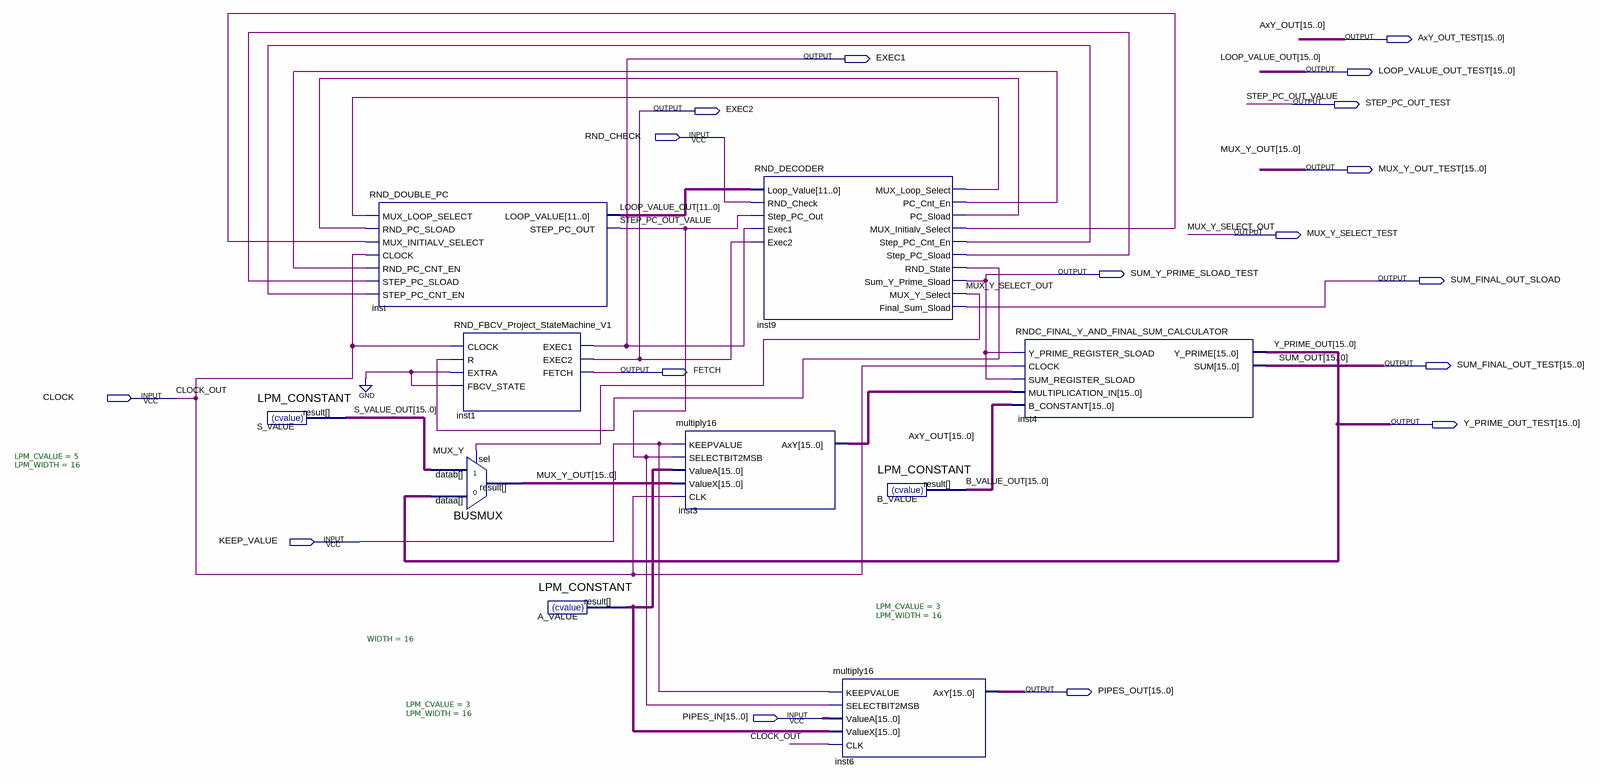
[diagram p0: schematic sheet]
// Quartus schematic RND_TESTING_V1.bdf as structural Verilog: 10 symbols, 17 pins
module RND_TESTING_V1 (
  input  RND_CHECK,
  input  CLOCK,
  input  KEEP_VALUE,
  input  [15:0] PIPES_IN,
  output [15:0] AxY_OUT_TEST,
  output EXEC1,
  output [15:0] LOOP_VALUE_OUT_TEST,
  output STEP_PC_OUT_TEST,
  output EXEC2,
  output [15:0] MUX_Y_OUT_TEST,
  output MUX_Y_SELECT_TEST,
  output SUM_Y_PRIME_SLOAD_TEST,
  output SUM_FINAL_OUT_SLOAD,
  output [15:0] SUM_FINAL_OUT_TEST,
  output FETCH,
  output [15:0] Y_PRIME_OUT_TEST,
  output [15:0] PIPES_OUT
);

  wire inst9_mux_initialv_select, inst9_mux_loop_select, inst9_pc_cnt_en, inst9_pc_sload, inst9_rnd_state,
       inst9_step_pc_cnt_en, inst9_step_pc_sload;
  wire [15:0] A_VALUE_result, B_VALUE_OUT, S_VALUE_OUT;

  LPM_CONSTANT #(.LPM_CVALUE(5), .LPM_WIDTH(16)) S_VALUE (.result(S_VALUE_OUT));
  RND_DOUBLE_PC inst (
    .MUX_LOOP_SELECT(inst9_mux_loop_select), .RND_PC_SLOAD(inst9_pc_sload),
    .MUX_INITIALV_SELECT(inst9_mux_initialv_select), .CLOCK(CLOCK), .RND_PC_CNT_EN(inst9_pc_cnt_en),
    .STEP_PC_SLOAD(inst9_step_pc_sload), .STEP_PC_CNT_EN(inst9_step_pc_cnt_en),
    .LOOP_VALUE(LOOP_VALUE_OUT_TEST[11:0]), .STEP_PC_OUT(STEP_PC_OUT_TEST));
  RND_FBCV_Project_StateMachine_V1 inst1 (
    .CLOCK(CLOCK), .R(inst9_rnd_state), .EXTRA(1'b0), .FBCV_STATE(1'b0), .EXEC1(EXEC1), .EXEC2(EXEC2),
    .FETCH(FETCH));
  BUSMUX #(.WIDTH(16)) MUX_Y (
    .datab(S_VALUE_OUT), .sel(MUX_Y_SELECT_TEST), .dataa(Y_PRIME_OUT_TEST), .result(MUX_Y_OUT_TEST));
  LPM_CONSTANT #(.LPM_CVALUE(3), .LPM_WIDTH(16)) A_VALUE (.result(A_VALUE_result));
  multiply16 inst3 (
    .KEEPVALUE(KEEP_VALUE), .SELECTBIT2MSB(STEP_PC_OUT_TEST), .ValueA(A_VALUE_result),
    .ValueX(MUX_Y_OUT_TEST), .CLK(CLOCK), .AxY(AxY_OUT_TEST));
  RND_DECODER inst9 (
    .Loop_Value(LOOP_VALUE_OUT_TEST[11:0]), .RND_Check(RND_CHECK), .Step_PC_Out(STEP_PC_OUT_TEST),
    .Exec1(EXEC1), .Exec2(EXEC2), .MUX_Loop_Select(inst9_mux_loop_select), .PC_Cnt_En(inst9_pc_cnt_en),
    .PC_Sload(inst9_pc_sload), .MUX_Initialv_Select(inst9_mux_initialv_select),
    .Step_PC_Cnt_En(inst9_step_pc_cnt_en), .Step_PC_Sload(inst9_step_pc_sload), .RND_State(inst9_rnd_state),
    .Sum_Y_Prime_Sload(SUM_Y_PRIME_SLOAD_TEST), .MUX_Y_Select(MUX_Y_SELECT_TEST),
    .Final_Sum_Sload(SUM_FINAL_OUT_SLOAD));
  multiply16 inst6 (
    .KEEPVALUE(KEEP_VALUE), .SELECTBIT2MSB(STEP_PC_OUT_TEST), .ValueA(PIPES_IN), .ValueX(A_VALUE_result),
    .CLK(CLOCK), .AxY(PIPES_OUT));
  LPM_CONSTANT #(.LPM_CVALUE(3), .LPM_WIDTH(16)) B_VALUE (.result(B_VALUE_OUT));
  RNDC_FINAL_Y_AND_FINAL_SUM_CALCULATOR inst4 (
    .Y_PRIME_REGISTER_SLOAD(SUM_Y_PRIME_SLOAD_TEST), .CLOCK(CLOCK),
    .SUM_REGISTER_SLOAD(SUM_Y_PRIME_SLOAD_TEST), .MULTIPLICATION_IN(AxY_OUT_TEST), .B_CONSTANT(B_VALUE_OUT),
    .Y_PRIME(Y_PRIME_OUT_TEST), .SUM(SUM_FINAL_OUT_TEST));

  // Other names for the same wires on the sheet: AxY_OUT[15:0] = AxY_OUT_TEST; CLOCK_OUT = CLOCK;
  //   LOOP_VALUE_OUT[15:0] = LOOP_VALUE_OUT_TEST; MUX_Y_OUT[15:0] = MUX_Y_OUT_TEST;
  //   MUX_Y_SELECT_OUT = MUX_Y_SELECT_TEST; STEP_PC_OUT_VALUE = STEP_PC_OUT_TEST; SUM_OUT[15:0] = SUM_FINAL_OUT_TEST;
  //   Y_PRIME_OUT[15:0] = Y_PRIME_OUT_TEST
endmodule
